# Altium schematic sheet M6_base.SchDoc
size 431 x 279 mm; SheetNumber: 1; SheetTotal: 1
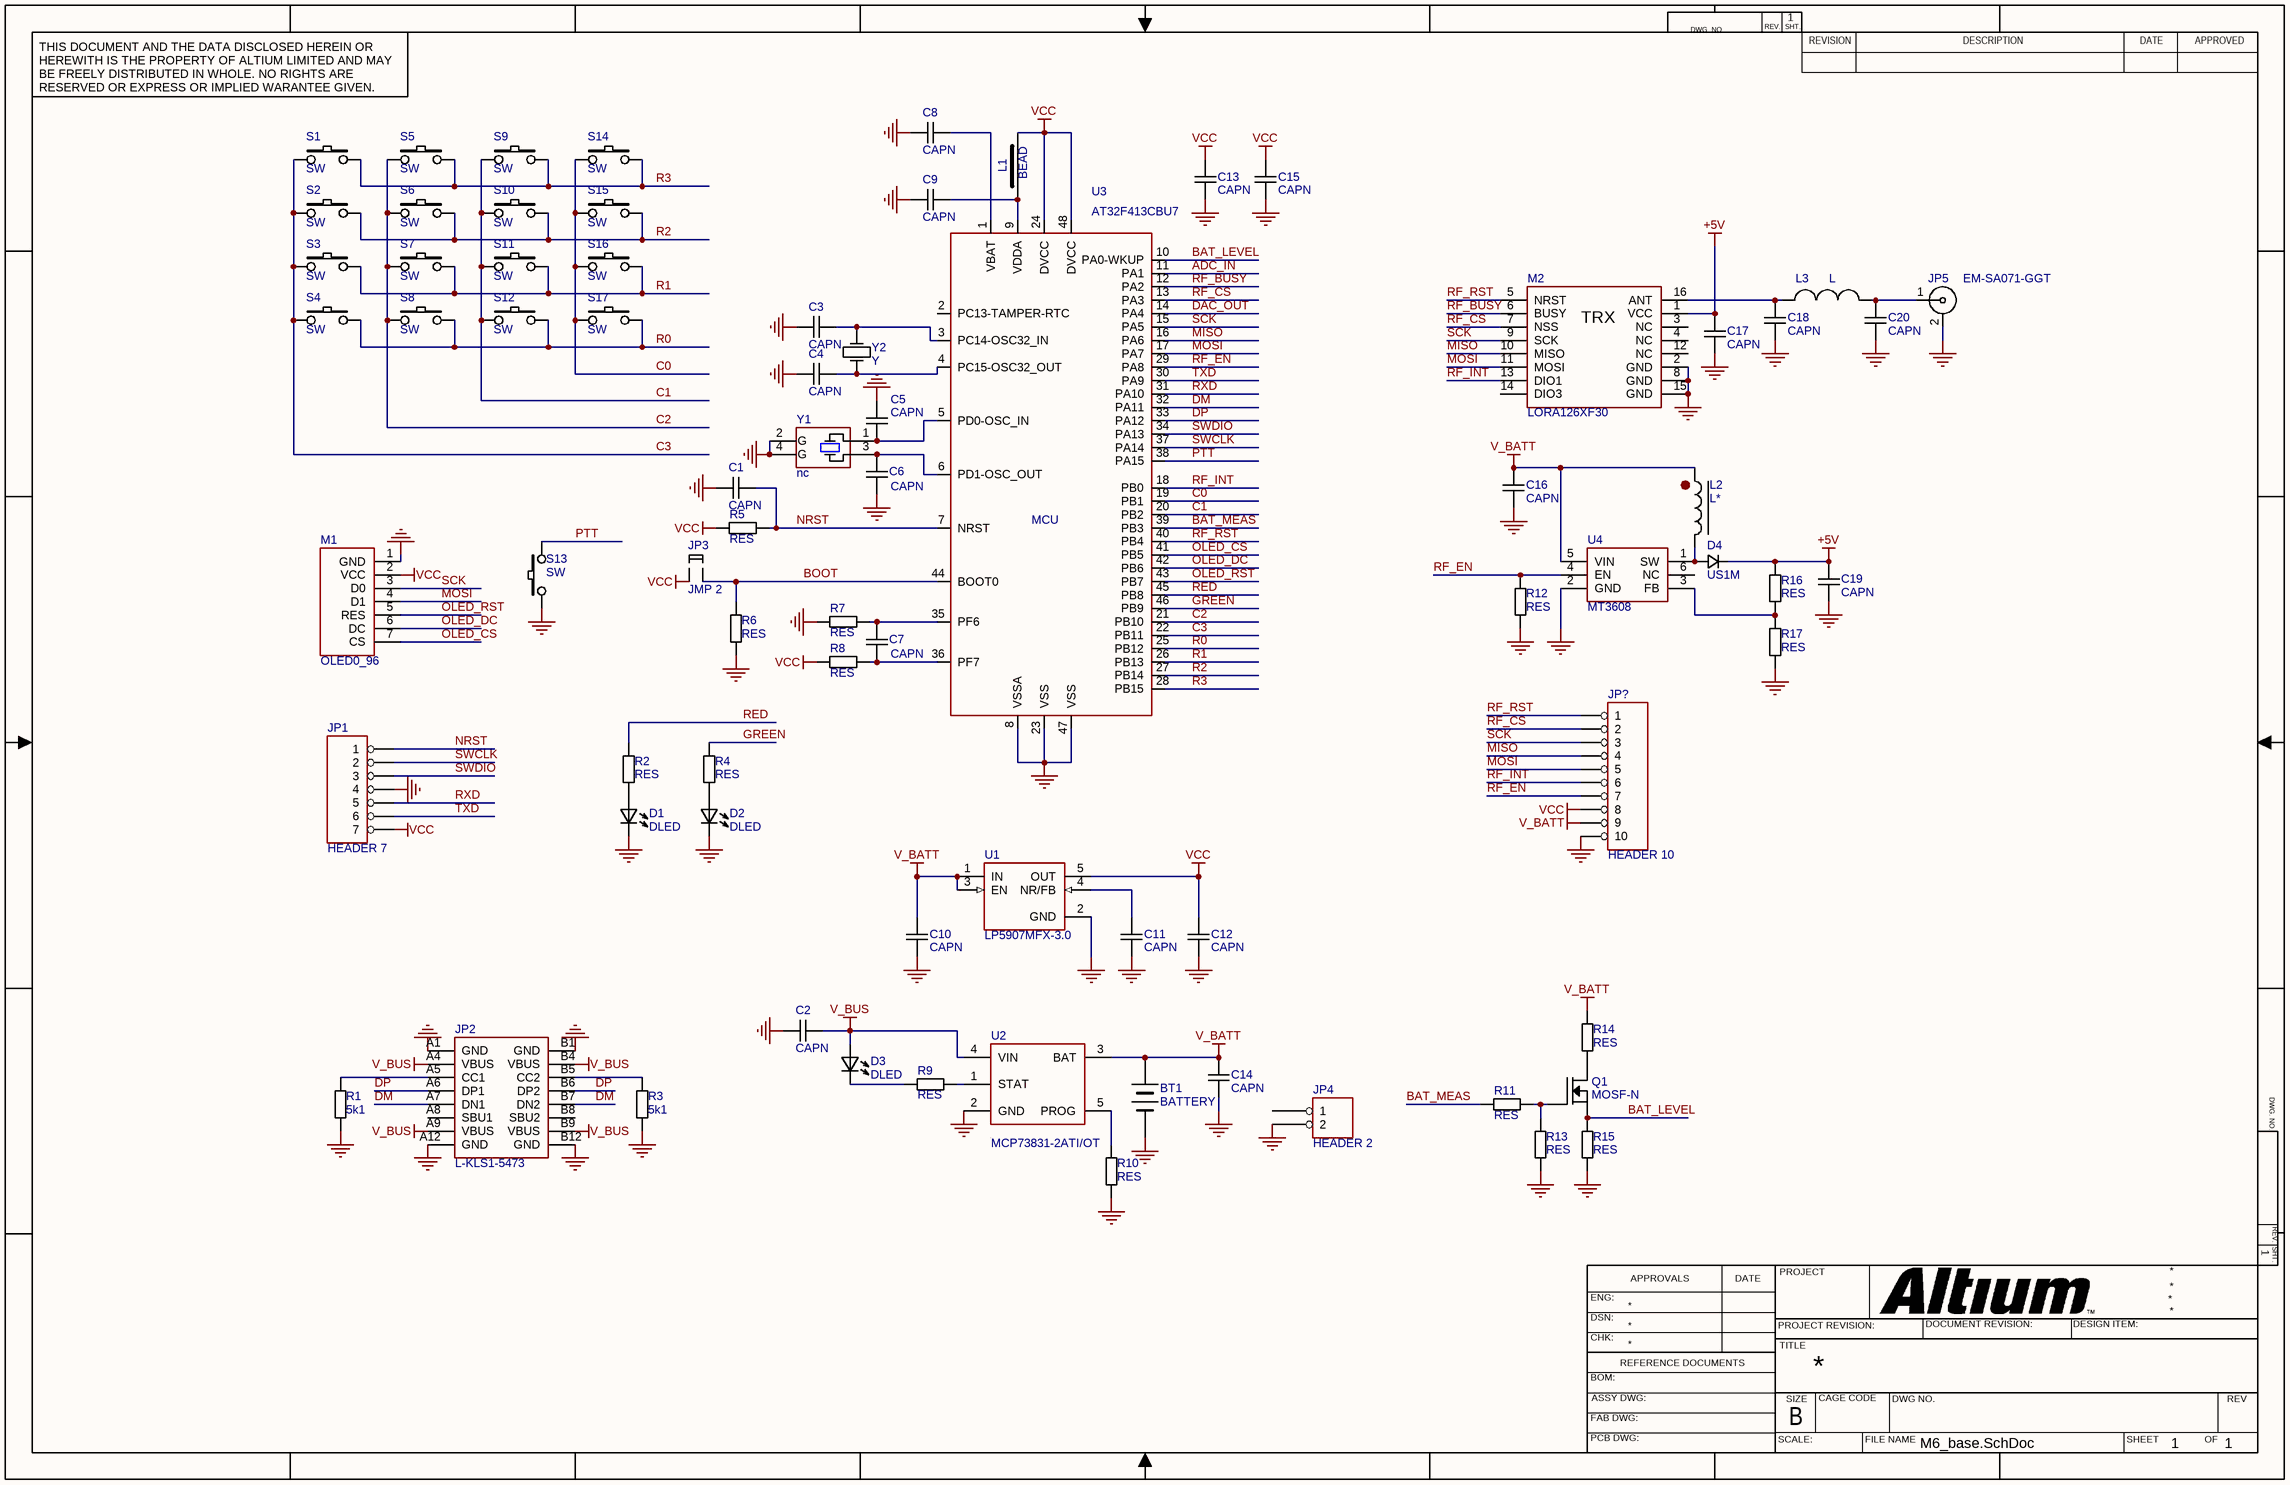
[diagram p0: M6_base.SchDoc]

## Parts
BT1  BATTERY  [18650]
C1  CAPN  [C-0603]
C2  CAPN  [C-0805]
C3  CAPN  [C-0603]
C4  CAPN  [C-0603]
C5  CAPN  [C-0603]
C6  CAPN  [C-0603]
C7  CAPN  [C-0603]
C8  CAPN  [C-0603]
C9  CAPN  [C-0603]
C10  CAPN  [C-0805]
C11  CAPN  [C-0603]
C12  CAPN  [C-0805]
C13  CAPN  [C-0603]
C14  CAPN  [C-0805]
C15  CAPN  [C-0603]
C16  CAPN  [C-0805]
C17  CAPN  [C-0805]
C18  CAPN  [C-0603]
C19  CAPN  [C-0805]
C20  CAPN  [C-0603]
D1  DLED  [R-0603]
D2  DLED  [LED_3mm_RED]
D3  DLED  [LED_3mm_RED]
D4  US1M  [DO-214AC(SMA)]
JP1  HEADER 7  [PLS1-7]
JP2  L-KLS1-5473  [L-KLS1-5473]
JP3  JMP 2  [R-0603]
JP4  HEADER 2  [PLS1-2]
JP5  EM-SA071-GGT  [SMA_F_EDGE]
JP?  HEADER 10  [PLS1-10]
L1  BEAD  [L-1210]
L2  L*  [CDRH6D38]
L3  L  [L-0603]
M1  OLED0_96  [OLED096]
M2  LORA126XF30  [LGA16_LORA126XF30]
Q1  MOSF-N  [SOT-23]
R1  5k1  [R-0603]
R2  RES  [R-0603]
R3  5k1  [R-0603]
R4  RES  [R-0603]
R5  RES  [R-0603]
R6  RES  [R-0603]
R7  RES  [R-0603]
R8  RES  [R-0603]
R9  RES  [R-0603]
R10  RES  [R-0603]
R11  RES  [R-0603]
R12  RES  [R-0603]
R13  RES  [R-0603]
R14  RES  [R-0603]
R15  RES  [R-0603]
R16  RES  [R-0603]
R17  RES  [R-0603]
S1  SW  [BUTT_MIN]
S2  SW  [BUTT_MIN]
S3  SW  [BUTT_MIN]
S4  SW  [BUTT_MIN]
S5  SW  [BUTT_MIN]
S6  SW  [BUTT_MIN]
S7  SW  [BUTT_MIN]
S8  SW  [BUTT_MIN]
S9  SW  [BUTT_MIN]
S10  SW  [BUTT_MIN]
S11  SW  [BUTT_MIN]
S12  SW  [BUTT_MIN]
S13  SW  [BUTT_MIN]
S14  SW  [BUTT_MIN]
S15  SW  [BUTT_MIN]
S16  SW  [BUTT_MIN]
S17  SW  [BUTT_MIN]
U1  LP5907MFX-3.0  [SOT-23-5]
U2  MCP73831-2ATI/OT  [SOT-23-5]
U3  AT32F413CBU7  [LQFP-48]
U4  MT3608  [SOT-23-6]
Y1  nc
Y2  Y  [KX-327]

## Nets
+5V: C17.1 C19.1 D4.2(K) M2.1(VCC) R16.2
GND: BT1.2(-) C1.1 C2.1 C3.1 C4.1 C5.1 C6.2 C8.2 C9.1 C10.2 C11.2 C12.2 C13.1 C14.1 C15.1 C16.2 C17.2 C18.2 C19.2 C20.2 D1.2 D2.2 JP1.4 JP2.A1(GND) JP2.A12(GND) JP2.B1(GND) JP2.B12(GND) JP4.2 JP5.2 JP?.10 M1.1(GND) M2.2(GND) M2.8(GND) M2.15(GND) R1.1 R3.1 R6.1 R7.1 R10.1 R12.1 R13.1 R15.1 R17.1 S13.1 U1.2(GND) U2.2(GND) U3.8(VSSA) U3.23(VSS) U3.47(VSS) U4.2(GND) Y1.2(GND) Y1.4(GND)
V_BATT: BT1.1(+) C10.1 C14.2 C16.1 JP?.9 L2.1 R14.2 U1.1(IN) U1.3(EN) U2.3(BAT) U4.5(VIN)
V_BUS: C2.2 D3.1 JP2.A4(VBUS) JP2.A9(VBUS) JP2.B4(VBUS) JP2.B9(VBUS) U2.4(VIN)
VCC: C12.1 C13.2 C15.2 JP1.7 JP3.1 JP?.8 L1.2 M1.2(VCC) R5.1 R8.1 U1.5(OUT) U3.24(DVCC) U3.48(DVCC)
ADC_IN: U3.11(PA1)
BAT_LEVEL: Q1.2(SOURCE) R15.2 U3.10(PA0-WKUP)
BAT_MEAS: R11.2 U3.39(PB3)
BOOT: JP3.2 R6.2 U3.44(BOOT0)
C0: S14.1 S15.1 S16.1 S17.1 U3.19(PB1)
C1: S9.1 S10.1 S11.1 S12.1 U3.20(PB2)
C2: S5.1 S6.1 S7.1 S8.1 U3.21(PB10)
C3: S1.1 S2.1 S3.1 S4.1 U3.22(PB11)
DAC_OUT: U3.14(PA4)
DM: JP2.A7(DN1) JP2.B7(DN2) U3.32(PA11)
DP: JP2.A6(DP1) JP2.B6(DP2) U3.33(PA12)
GREEN: R4.2 U3.46(PB9)
MISO: JP?.4 M2.10(MISO) U3.16(PA6)
MOSI: JP?.5 M1.4(D1) M2.11(MOSI) U3.17(PA7)
NRST: C1.2 JP1.1 R5.2 U3.7(NRST)
OLED_CS: M1.7(CS) U3.41(PB5)
OLED_DC: M1.6(DC) U3.42(PB6)
OLED_RST: M1.5(RES) U3.43(PB7)
PTT: S13.2 U3.38(PA15)
R0: S4.2 S8.2 S12.2 S17.2 U3.25(PB12)
R1: S3.2 S7.2 S11.2 S16.2 U3.26(PB13)
R2: S2.2 S6.2 S10.2 S15.2 U3.27(PB14)
R3: S1.2 S5.2 S9.2 S14.2 U3.28(PB15)
RED: R2.2 U3.45(PB8)
RF_BUSY: M2.6(BUSY) U3.12(PA2)
RF_CS: JP?.2 M2.7(NSS) U3.13(PA3)
RF_EN: JP?.7 R12.2 U3.29(PA8) U4.4(EN)
RF_INT: JP?.6 M2.13(DIO1) U3.18(PB0)
RF_RST: JP?.1 M2.5(NRST) U3.40(PB4)
RXD: JP1.5 U3.31(PA10)
SCK: JP?.3 M1.3(D0) M2.9(SCK) U3.15(PA5)
SWCLK: JP1.2 U3.37(PA14)
SWDIO: JP1.3 U3.34(PA13)
TXD: JP1.6 U3.30(PA9)
NetC3_2: C3.2 U3.3(PC14-OSC32_IN) Y2.2
NetC4_2: C4.2 U3.4(PC15-OSC32_OUT) Y2.1
NetC5_2: C5.2 U3.5(PD0-OSC_IN) Y1.1
NetC6_1: C6.1 U3.6(PD1-OSC_OUT) Y1.3
NetC7_1: C7.1 R7.2 U3.35(PF6)
NetC7_2: C7.2 R8.2 U3.36(PF7)
NetC8_1: C8.1 U3.1(VBAT)
NetC9_2: C9.2 L1.1 U3.9(VDDA)
NetC11_1: C11.1 U1.4(NR/FB)
NetC18_1: C18.1 L3.1 M2.16(ANT)
NetC20_1: C20.1 JP5.1 L3.2
NetD1_1: D1.1 R2.1
NetD2_1: D2.1 R4.1
NetD3_2: D3.2 R9.2
NetD4_1: D4.1(A) L2.2 U4.1(SW)
NetJP2_A5: JP2.A5(CC1) R1.2
NetJP2_B5: JP2.B5(CC2) R3.2
NetQ1_1: Q1.1(GATE) R11.1 R13.2
NetQ1_3: Q1.3(DRAIN) R14.1
NetR9_1: R9.1 U2.1(STAT)
NetR10_2: R10.2 U2.5(PROG)
NetR16_1: R16.1 R17.2 U4.3(FB)

Not connected (* = marked no-connect by the designer): JP2 17(VSS) A8(SBU1) B8(SBU2); JP4 1; M2 3(NC) 4(NC) 12(NC) 14(DIO3); U3 2(PC13-TAMPER-RTC); U4 6(NC)

## Notes on the sheet
- DWG. NO.
- REV.
- SHT.
- THIS DOCUMENT AND THE DATA DISCLOSED HEREIN OR HEREWITH IS THE PROPERTY OF ALTIUM LIMITED AND MAY BE FREELY DISTRIBUTED IN WHOLE. NO RIGHTS ARE RESERVED OR EXPRESS OR IMPLIED WARANTEE GIVEN.
- REVISION
- DESCRIPTION
- DATE
- APPROVED
- ENG:
- APPROVALS
- PROJECT
- DSN:
- CHK:
- REFERENCE DOCUMENTS
- PROJECT REVISION:
- TITLE
- DOCUMENT REVISION:
- DESIGN ITEM:
- BOM:
- FAB DWG:
- PCB DWG:
- ASSY DWG:
- SCALE:
- SIZE
- B
- CAGE CODE
- FILE NAME
- DWG NO.
- SHEET
- OF
- REV
- (in symbol AT32F413CBU7) MCU
- (in symbol LORA126XF30) TRX
- (in symbol TSX-3225) G

## Library data of the parts
C1-C20 = CAPN: Voltage: 50V; Точність/група: NP0; Вид: Конденсатор
D1-D3 = DLED: Вид: Світлодіод
JP1 = HEADER 7: Вид: Роз'єм; *: *
JP2 = L-KLS1-5473: Mounting  Method: SMD; Value: *
JP3 = JMP 2: Вид: Роз'єм
JP4 = HEADER 2: Вид: Роз'єм; *: *
JP5 = SMA: SMA Female R/A PCB Mount; Вид: Роз'єм
JP? = HEADER 10: Вид: Роз'єм; *: *
L1 = BEAD: Вид: Ferrite bead
L2 = L*: Вид: Індуктивність
L3 = L: Вид: Індуктивність
Q1 = MOSF-N: Вид: Транзистор
R1-R17 = RES: Точність/група: 5%; Вид: Резистор
S1-S17 = SW-PUSHBUTTON: Вид: Кнопка; Виробник: *; *: *
U1 = LP5907: 250mA Low-Dropout Regulator; Вид: Мікросхема
U2 = MCP73831-2ATI/OT: Library Part: IC`s.SchLib; Manufacturer: Texas Instruments; Man#Part Num#: TPS61023DRLT; Value: {Value}; Mounting  Method: SMD; IC Type: PMIC; Part Number: MCP73831-2ATI/OT; Footprint Part: IC-package.PcbLib; Package: SOT-563; Part Type: IC; Component Type: SMD; Temperature Range: -40°C ~ 125°C (TJ); URL: https://www.ti.com/general/docs/suppproductinfo.tsp?distId=10&gotoUrl=https%3A%2F%2Fwww.ti.com%2Flit%2Fgpn%2Ftps61023; Suplier 1: https://www.digikey.com.au/en/products/detail/texas-instruments/TPS61023DRLT/11310622?s=N4IgTCBcDaICoAUDKA2AjABjAZgCICUAZOEAXQF8g
U3 = AT32F413CBU7: Вид: Мікросхема
Y1 = TSX-3225: Crystal, 24 MHz, 9 pF, SMD; Вид: Трансформатор
Y2 = Y: Точність/група: 20ppm; Вид: Кварц
D4 = US1M: Value: *